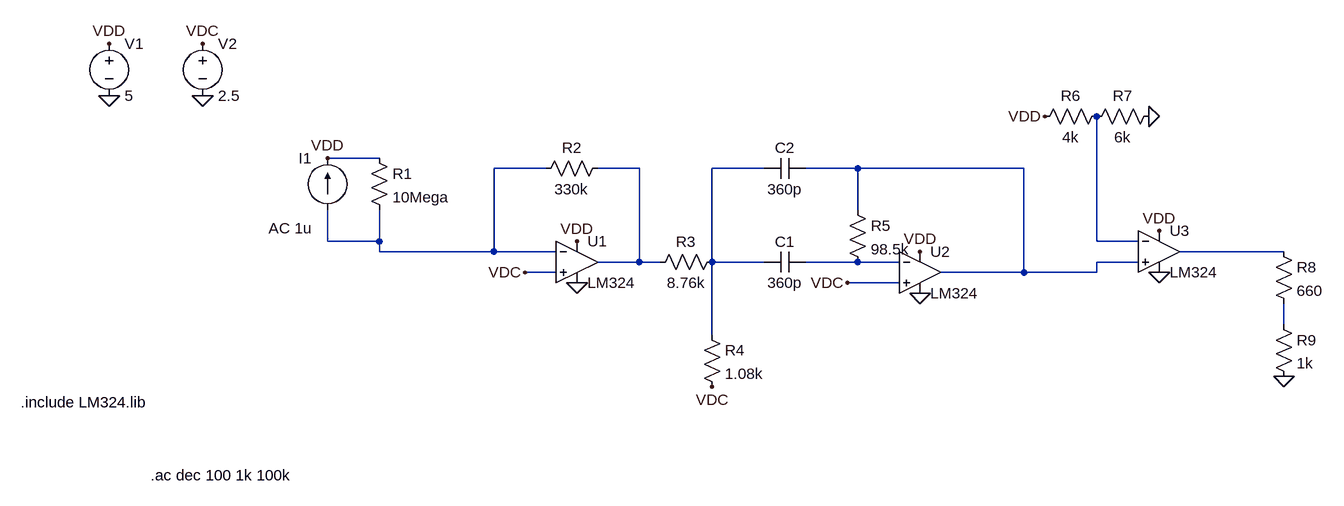
[diagram p0: schematic receiver-chain-ac-response.asc]
receiver-chain-ac-response.asc, the LTspice schematic file:
Version 4.1
SHEET 1 1140 680
WIRE -320 80 -400 80
WIRE -64 96 -144 96
WIRE 80 96 16 96
WIRE 272 96 192 96
WIRE 416 96 336 96
WIRE 672 96 416 96
WIRE 416 160 416 96
WIRE -400 208 -400 160
WIRE -320 208 -320 160
WIRE -320 208 -400 208
WIRE 784 208 784 16
WIRE 848 208 784 208
WIRE -320 224 -320 208
WIRE -144 224 -144 96
WIRE -144 224 -320 224
WIRE -48 224 -144 224
WIRE 1072 224 912 224
WIRE 80 240 80 96
WIRE 80 240 16 240
WIRE 112 240 80 240
WIRE 192 240 192 96
WIRE 272 240 192 240
WIRE 416 240 336 240
WIRE 480 240 416 240
WIRE 848 240 784 240
WIRE -48 256 -96 256
WIRE 672 256 672 96
WIRE 672 256 544 256
WIRE 784 256 784 240
WIRE 784 256 672 256
WIRE 480 272 400 272
WIRE 1072 336 1072 304
WIRE 192 352 192 240
FLAG -736 -16 0
FLAG -736 -96 VDD
FLAG -400 80 VDD
FLAG -16 208 VDD
FLAG -16 272 0
FLAG 400 272 VDC
FLAG 192 432 VDC
FLAG 864 16 0
FLAG 704 16 VDD
FLAG 880 192 VDD
FLAG 512 224 VDD
FLAG 512 288 0
FLAG 880 256 0
FLAG -592 -96 VDC
FLAG -592 -16 0
FLAG 1072 416 0
FLAG -96 256 VDC
SYMBOL voltage -736 -112 R0
WINDOW 123 0 0 Left 0
WINDOW 39 0 0 Left 0
SYMATTR InstName V1
SYMATTR Value 5
SYMBOL current -400 160 R180
WINDOW 0 24 80 Left 2
WINDOW 3 24 0 Left 2
WINDOW 123 24 -28 Left 2
WINDOW 39 0 0 Left 0
SYMATTR InstName I1
SYMATTR Value ""
SYMATTR Value2 AC 1u
SYMBOL res -336 64 R0
SYMATTR InstName R1
SYMATTR Value 10Mega
SYMBOL res 32 80 R90
WINDOW 0 0 56 VBottom 2
WINDOW 3 32 56 VTop 2
SYMATTR InstName R2
SYMATTR Value 330k
SYMBOL res 208 224 R90
WINDOW 0 0 56 VBottom 2
WINDOW 3 32 56 VTop 2
SYMATTR InstName R3
SYMATTR Value 8.76k
SYMBOL res 176 336 R0
SYMATTR InstName R4
SYMATTR Value 1.08k
SYMBOL cap 336 224 R90
WINDOW 0 0 32 VBottom 2
WINDOW 3 32 32 VTop 2
SYMATTR InstName C1
SYMATTR Value 360p
SYMBOL res 400 144 R0
SYMATTR InstName R5
SYMATTR Value 98.5k
SYMBOL cap 336 80 R90
WINDOW 0 0 32 VBottom 2
WINDOW 3 32 32 VTop 2
SYMATTR InstName C2
SYMATTR Value 360p
SYMBOL res 800 0 R90
WINDOW 0 0 56 VBottom 2
WINDOW 3 32 56 VTop 2
SYMATTR InstName R6
SYMATTR Value 4k
SYMBOL res 880 0 R90
WINDOW 0 0 56 VBottom 2
WINDOW 3 32 56 VTop 2
SYMATTR InstName R7
SYMATTR Value 6k
SYMBOL voltage -592 -112 R0
SYMATTR InstName V2
SYMATTR Value 2.5
SYMBOL res 1056 208 R0
SYMATTR InstName R8
SYMATTR Value 660
SYMBOL res 1056 320 R0
SYMATTR InstName R9
SYMATTR Value 1k
SYMBOL sym\\OpAmps\\opamp2 -16 176 R0
SYMATTR InstName U1
SYMATTR Value LM324
SYMATTR SpiceModel LM324
SYMBOL sym\\OpAmps\\opamp2 512 192 R0
SYMATTR InstName U2
SYMATTR Value LM324
SYMATTR SpiceModel LM324
SYMBOL sym\\OpAmps\\opamp2 880 160 R0
SYMATTR InstName U3
SYMATTR Value LM324
SYMATTR SpiceModel LM324
TEXT -872 456 Left 2 !.include LM324.lib
TEXT -672 568 Left 2 !.ac dec 100 1k 100k

The netlist it stands for:
* receiver-chain-ac-response.asc
V1 VDD 0 5
I1 N001 VDD AC 1u
R1 VDD N001 10Mega
R2 N002 N001 330k
R3 N003 N002 8.76k
R4 N003 VDC 1.08k
C1 N007 N003 360p
R5 N004 N007 98.5k
C2 N004 N003 360p
R6 N005 VDD 4k
R7 0 N005 6k
V2 VDC 0 2.5
R8 N006 N008 660
R9 N008 0 1k
X§U1 VDC N001 VDD 0 N002 LM324 LM324  ; pins In+ In- V+ V- OUT
X§U2 VDC N007 VDD 0 N004 LM324 LM324  ; pins In+ In- V+ V- OUT
X§U3 N004 N005 VDD 0 N006 LM324 LM324  ; pins In+ In- V+ V- OUT
.include LM324.lib
.ac dec 100 1k 100k
.backanno
.end